# Altium schematic sheet Sensor.SchDoc
size A4
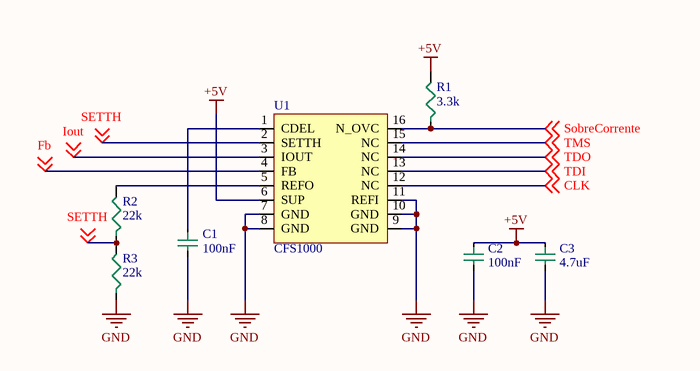
[diagram p0: Sensor.SchDoc]

## Parts
C1  value 100nF  [0603C]  (hidden comment: 0603)
C2  value 100nF  [0603C]  (hidden comment: 0603)
C3  value 4.7uF  [0603C]  (hidden comment: 0603)
R1  value 3.3k  [0603]  (hidden comment: 0603)
R2  value 22k  [0603]  (hidden comment: 0603)
R3  value 22k  [0603]  (hidden comment: 0603)
U1  CFS1000  [SO16w]

## Nets
+5V: C2.1 C3.1 R1.2 U1.6(SUP)
GND: C1.2 C2.2 C3.2 R3.1 U1.7(GND) U1.8(GND) U1.9(GND) U1.10(GND) U1.11(REFI)
CLK: U1.12(NC) ; off-sheet CLK
Fb: U1.4(FB) ; off-sheet Fb
Iout: U1.3(IOUT) ; off-sheet Iout
SETTH: R2.1 R3.2 U1.2(SETTH) ; off-sheet SETTH
SobreCorrente: R1.1 U1.16(N_OVC) ; off-sheet SobreCorrente
TDI: U1.13(NC) ; off-sheet TDI
TDO: U1.14(NC) ; off-sheet TDO
TMS: U1.15(NC) ; off-sheet TMS
NetC1_1: C1.1 U1.1(CDEL)
NetR2_2: R2.2 U1.5(REFO)

## Library data of the parts
C1-C3 = Capacitor SMD 0603
R1-R3 = Resistor SMD 0603 1/10 W: %: ±1%; P: 1/8W
U1 = CI CFS1000: CFS1000 magneto resistive current sensor; ComponentLink1Description: Documentação; ComponentLink1URL: https://www.sensitec.com/service-support/download/file-category/current